# EAGLE design msmobilshield (EAGLE 7.6.0)
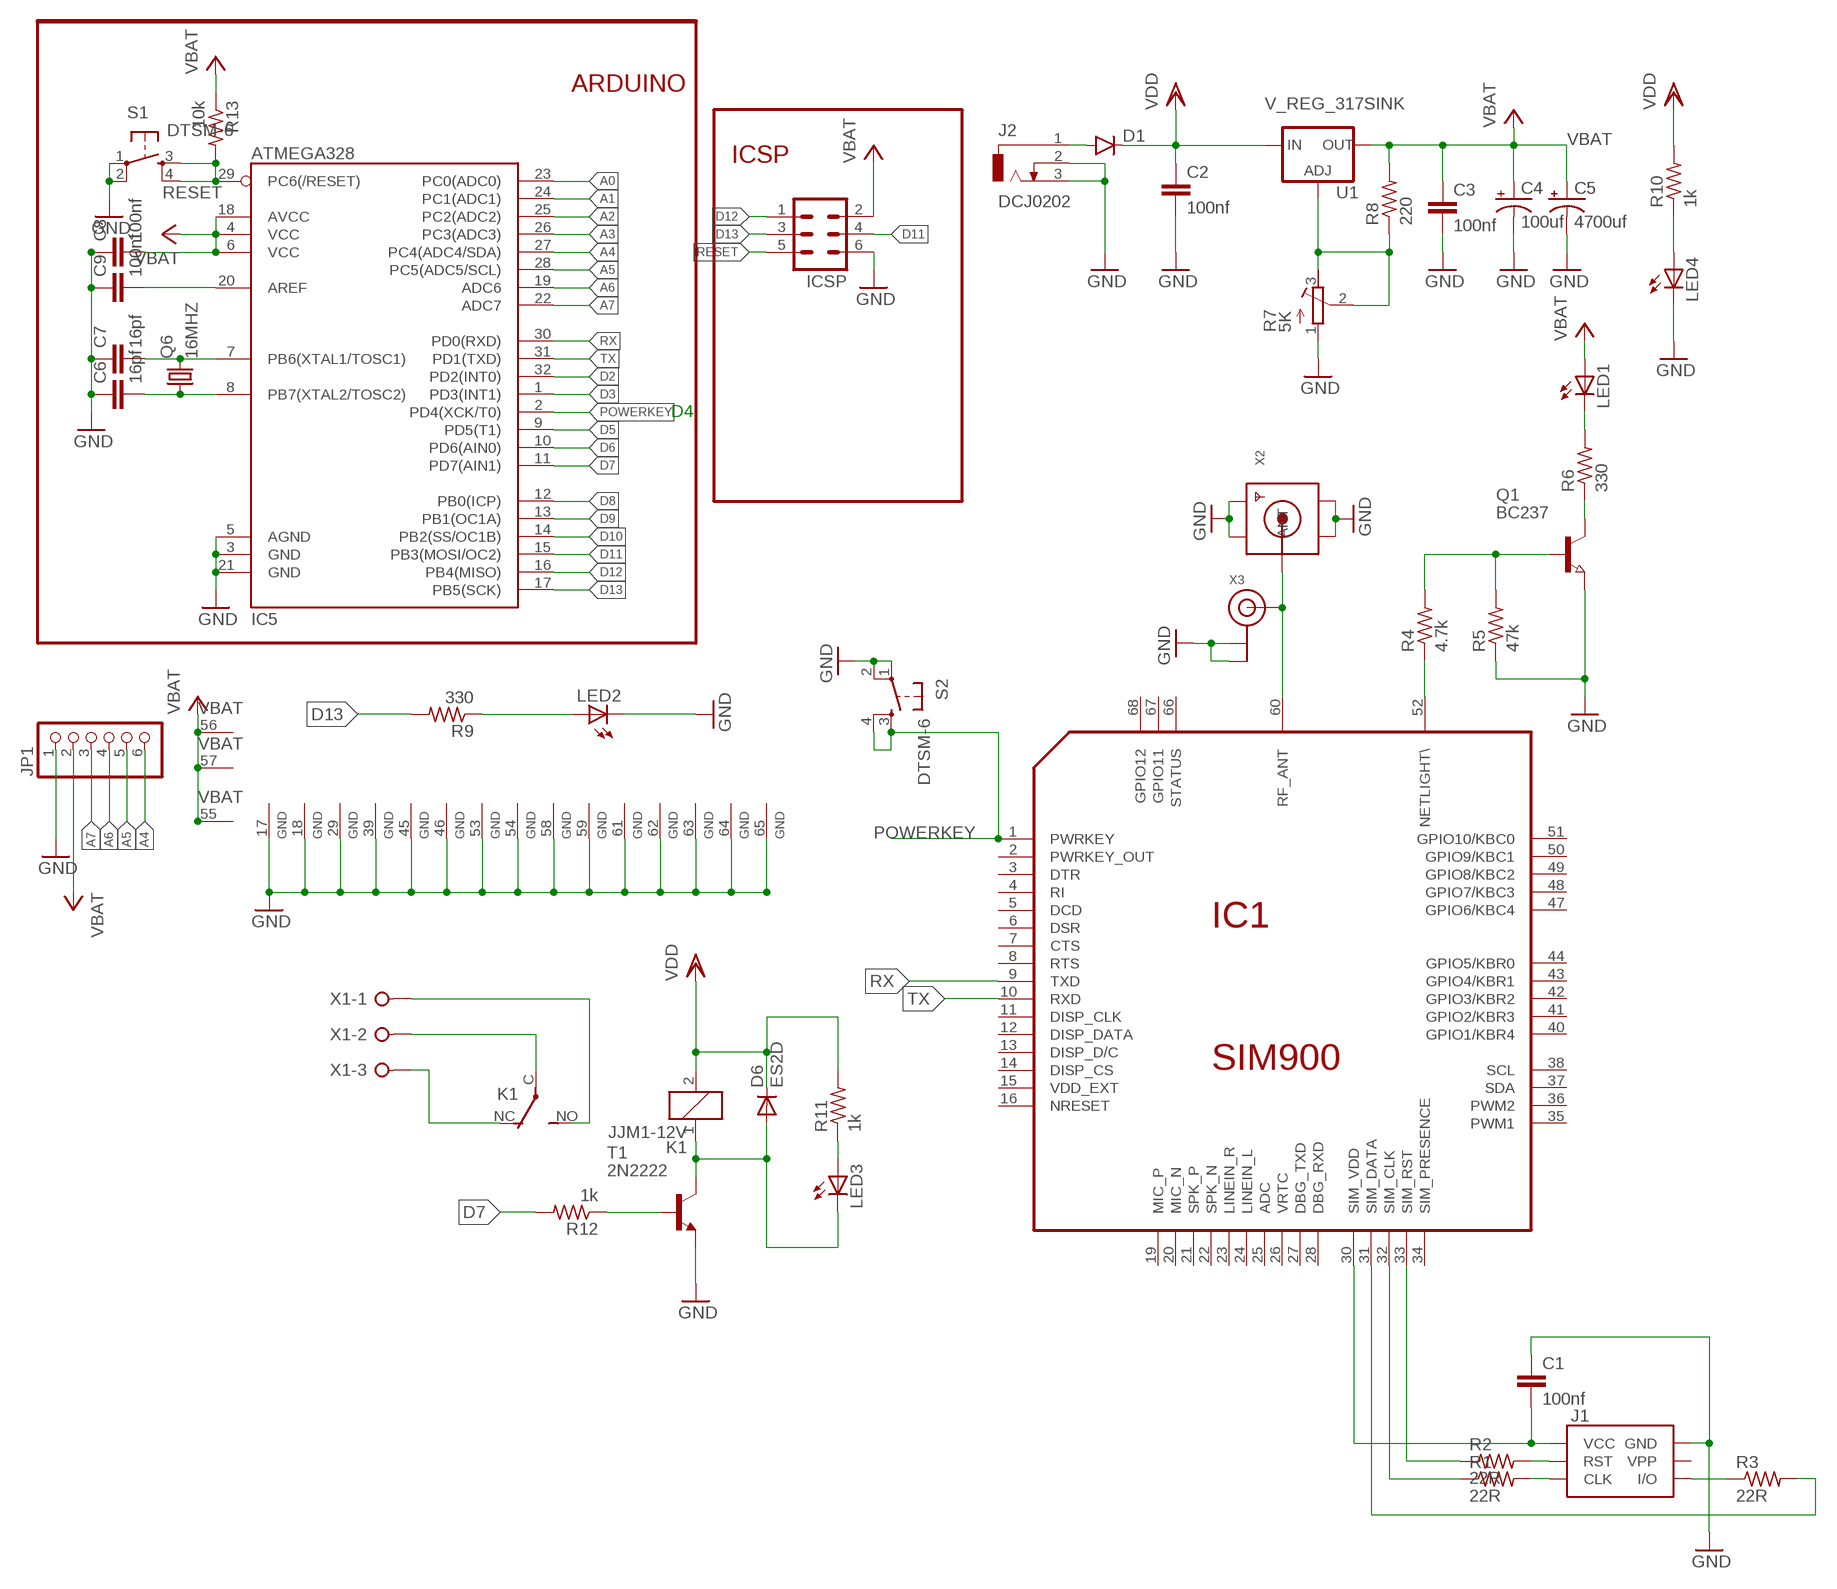
[diagram p0: schematic, sheet 1]

## Parts
C1  100nf  C-EUC0805  [C0805]
C2  100nf  C-EUC0805  [C0805]
C3  100nf  C-EUC0805  [C0805]
C4  100uf  100UF-25V-20%(PTH)  [CPOL-RADIAL-100UF-25V]
C5  4700uf  1000UF-25V(PTH)  [CPOL-RADIAL-1000UF-25V]
C6  16pf  C-EUC0805  [C0805]
C7  16pf  C-EUC0805  [C0805]
C8  100nf  C-EUC0805  [C0805]
C9  100nf  C-EUC0805  [C0805]
D1  DIODESMA  [SMA-DIODE]
D6  ES2D  [SMB]
IC1  SIM900  [SIM900]
IC5  ATMEGA328  ATMEGA168  [TQFP32-08]
ICSP  ML6  [ML6]
J1  SIMHOLDERSIM  [SIMHOLDER]
J2  DCJ0202  [DCJ0202]
JP1  PINHD-1X6  [1X06]
K1  JJM1-12V  [JJM1C]
LED1  LEDCHIPLED_0805  [CHIPLED_0805]
LED2  LEDCHIPLED_0805  [CHIPLED_0805]
LED3  LEDCHIPLED_0805  [CHIPLED_0805]
LED4  LEDCHIPLED_0805  [CHIPLED_0805]
Q1  BC237  NPN-TRANSISTOR_SOT23  [SOT23]
Q6  16MHZ  CRYSTALHC49S  [HC49/S]
R1  22R  R-US_R0805  [R0805]
R2  22R  R-US_R0805  [R0805]
R3  22R  R-US_R0805  [R0805]
R4  4.7k  R-US_R0805  [R0805]
R5  47k  R-US_R0805  [R0805]
R6  330  R-US_R0805  [R0805]
R7  5K  R-TRIMM3103  [RTRIM3103]
R8  220  R-US_R0805  [R0805]
R9  330  R-US_R0805  [R0805]
R10  1k  R-US_R0805  [R0805]
R11  1k  R-US_R0805  [R0805]
R12  1k  R-US_R0805  [R0805]
R13  10k  R-US_R0805  [R0805]
S1  DTSM-6  [DTSM-6]
S2  DTSM-6  [DTSM-6]
T1  2N2222  MMBT2222ALT1-NPN-SOT23-BEC  [SOT23-BEC]
U1  V_REG_317SINK  [TO220-ADJ]
X1  W237-3E  [W237-3E]
X2  SMACONNECTOR  [SMA90_DIP]
X3  ANTENNA_U.FL  [U.FL]

## Nets
A0: IC5.23(PC0(ADC0))
A1: IC5.24(PC1(ADC1))
A2: IC5.25(PC2(ADC2))
A3: IC5.26(PC3(ADC3))
A4: IC5.27(PC4(ADC4/SDA)) JP1.6
A5: IC5.28(PC5(ADC5/SCL)) JP1.5
A6: IC5.19(ADC6) JP1.4
A7: IC5.22(ADC7) JP1.3
D2: IC5.32(PD2(INT0))
D3: IC5.1(PD3(INT1))
D5: IC5.9(PD5(T1))
D6: IC5.10(PD6(AIN0))
D7: IC5.11(PD7(AIN1)) R12.2
D8: IC5.12(PB0(ICP))
D9: IC5.13(PB1(OC1A))
D10: IC5.14(PB2(SS/OC1B))
D11: IC5.15(PB3(MOSI/OC2)) ICSP.4
D12: IC5.16(PB4(MISO)) ICSP.1
D13: IC5.17(PB5(SCK)) ICSP.3 R9.2
GND: C1.1 C2.2 C3.2 C4.2(-) C5.- C6.1 C7.1 C8.1 C9.1 IC1.17(GND) IC1.18(GND) IC1.29(GND) IC1.39(GND) IC1.45(GND) IC1.46(GND) IC1.53(GND) IC1.54(GND) IC1.58(GND) IC1.59(GND) IC1.61(GND) IC1.62(GND) IC1.63(GND) IC1.64(GND) IC1.65(GND) IC5.3(GND) IC5.5(AGND) IC5.21(GND) ICSP.6 J1.C5(GND) J2.2 J2.3 JP1.1 LED2.C LED4.C Q1.2(E) R5.1 R7.1(A) S1.1 S1.2 S2.1 S2.2 T1.E X2.GND1 X2.GND2 X2.GND3 X2.GND4 X3.1(GND) X3.2(GND)
N$1: J1.C2(RST) R2.2
N$2: J1.C3(CLK) R1.2
N$3: J1.C7(I/O) R3.1
N$4: IC1.33(SIM_RST) R2.1
N$5: IC1.32(SIM_CLK) R1.1
N$6: IC1.31(SIM_DATA) R3.2
N$7: C1.2 IC1.30(SIM_VDD) J1.C1(VCC)
N$8: IC1.60(RF_ANT) X2.ANTENNA(ANT) X3.3(SIGNAL)
N$9: IC1.52(NETLIGHT\) R4.1
N$10: Q1.1(B) R4.2 R5.2
N$11: K1.C(2:P) X1.2
N$12: Q1.3(C) R6.1
N$13: LED1.C R6.2
N$14: K1.NC(2:O) X1.3
N$15: D1.A J2.1
N$16: K1.NO(2:S) X1.1
N$17: R7.2(S) R7.3(E) R8.1 U1.ADJ
N$18: LED2.A R9.1
N$19: LED4.A R10.1
N$34: C7.2 IC5.7(PB6(XTAL1/TOSC1)) Q6.2
N$35: C6.2 IC5.8(PB7(XTAL2/TOSC2)) Q6.1
N$36: C9.2 IC5.20(AREF)
N$38: R12.1 T1.B
N$40: D6.A K1.1 LED3.C T1.C
N$41 [vcc]: LED3.A R11.1
POWERKEY: IC1.1(PWRKEY) IC5.2(PD4(XCK/T0)) S2.3 S2.4
RESET: IC5.29(PC6(/RESET)) ICSP.5 R13.2 S1.3 S1.4
RX: IC1.9(TXD) IC5.30(PD0(RXD))
TX: IC1.10(RXD) IC5.31(PD1(TXD))
VBAT: C3.1 C4.1(+) C5.+ C8.2 IC1.55(VBAT) IC1.56(VBAT) IC1.57(VBAT) IC5.4(VCC) IC5.6(VCC) IC5.18(AVCC) ICSP.2 JP1.2 LED1.A R8.2 R13.1 U1.OUT
VDD: C2.1 D1.C D6.C K1.2 R10.2 R11.2 U1.IN
Unconnected: IC1.2(PWRKEY_OUT) IC1.3(DTR) IC1.4(RI) IC1.5(DCD) IC1.6(DSR) IC1.7(CTS) IC1.8(RTS) IC1.11(DISP_CLK) IC1.12(DISP_DATA) IC1.13(DISP_D/C) IC1.14(DISP_CS) IC1.15(VDD_EXT) IC1.16(NRESET) IC1.19(MIC_P) IC1.20(MIC_N) IC1.21(SPK_P) IC1.22(SPK_N) IC1.23(LINEIN_R) IC1.24(LINEIN_L) IC1.25(ADC) IC1.26(VRTC) IC1.27(DBG_TXD) IC1.28(DBG_RXD) IC1.34(SIM_PRESENCE) IC1.35(PWM1) IC1.36(PWM2) IC1.37(SDA) IC1.38(SCL) IC1.40(GPIO1/KBR4) IC1.41(GPIO2/KBR3) IC1.42(GPIO3/KBR2) IC1.43(GPIO4/KBR1) IC1.44(GPIO5/KBR0) IC1.47(GPIO6/KBC4) IC1.48(GPIO7/KBC3) IC1.49(GPIO8/KBC2) IC1.50(GPIO9/KBC1) IC1.51(GPIO10/KBC0) IC1.66(STATUS) IC1.67(GPIO11) IC1.68(GPIO12) J1.C6(VPP)

## Notes on the sheet
- ARDUINO
- ICSP
- D4

## Library data of the parts
C1-C3 C6-C9 = resistor:C-EU: CAPACITOR, European symbol
C4 = SparkFun-Capacitors:100UF-25V-20%(PTH): CAP-08439; PROD_ID: CAP-08439
C5 = SparkFun-Capacitors:1000UF-25V(PTH): CAP-08070; PROD_ID: CAP-09538; VALUE: CAP-09538
D1 = SparkFun-DiscreteSemi:DIODE: Diode These are standard reverse protection diodes and small signal diodes. SMA package can handle up to about 1A. SOD-323 can handle about 200mA. What the SOD-323 package when ordering, there are some mfgs out there that are 5-pin packages.
D6 = diode:ES2D: DIODE super fast rectifier, 2 A
IC1 = sim900:SIM900
IC5 = SparkFun:ATMEGA168
ICSP = con-harting-ml:ML6: HARTING
J1 = SparkFun-Connectors:SIMHOLDER: SIM Socket Socket for SIM cellular cards. Schematic element and footprint production proven. Spark Fun Electronics SKU : PRT-00548; PROD_ID: CONN-08536
J2 = con-jack:DCJ0202: DC POWER JACK Source: DCJ0202.pdf; OC_FARNELL: unknown; OC_NEWARK: unknown
JP1 = adafruit:PINHD-1X6: PIN HEADER
K1 = relay:JJM1-12V: HALF-SIZE AUTOMOTIVE RELAY NAiS Source: http://www.mew-europe.com/.. en_ds_61210_0001.pdf; MF: AROMAT/ MATSUSHITA; MPN: JJM1-12V; OC_FARNELL: unknown; OC_NEWARK: 10C7318
LED1-LED4 = adafruit:LED: LED OSRAM: - CHIPLED LG R971, LG N971, LY N971, LG Q971, LY Q971, LO R971, LY R971 LH N974, LH R974 LS Q976, LO Q976, LY Q976 LO Q996 - Hyper CHIPLED LW Q18S LB Q993, LB Q99A, LB R99A - SideLED LS A670, LO A670, LY A670, LG A670, LP A670 LB A673, LV A673, LT A673, LW A673 LH A674 LY A675 LS A676, LA A676, LO A676, LY A676, LW A676 LS A679, LY A679, LG A679 - Hyper Micro SIDELED® LS Y876, LA Y876, LO Y876, LY Y876 LT Y87S - SmartLED LW L88C, LW L88S LB L89C, LB L89S, LG L890 LS L89K, LO L89K, LY L89K LS L896, LA L896, LO L896, LY L896 - TOPLED LS T670, LO T670, LY T670, LG T670, LP T670 LSG T670, LSP T670, LSY T670, LOP T670, LYG T670 LG T671, LOG T671, LSG T671 LB T673, LV T673, LT T673, LW T673 LH T674 LS T676, LA T676, LO T676, LY T676, LB T676, LH T676, LSB T676, LW T676 LB T67C, LV T67C, LT T67C, LS T67K, LO T67K, LY T67K, LW E67C LS E67B, LA E67B, LO E67B, LY E67B, LB E67C, LV E67C, LT E67C LW T67C LS T679, LY T679, LG T679 LS T770, LO T770, LY T770, LG T770, LP T770 LB T773, LV T773, LT T773, LW T773 LH T774 LS E675, LA E675, LY E675, LS T675 LS T776, LA T776, LO T776, LY T776, LB T776 LHGB T686 LT T68C, LB T68C - Hyper Mini TOPLED® LB M676 - Mini TOPLED Santana® LG M470 LS M47K, LO M47K, LY M47K Source: http://www.osram.convergy.de/
Q1 = semicon-smd-ipc:NPN-TRANSISTOR_: NPN TRANSISTOR
Q6 = crystal:CRYSTAL: CRYSTAL
R1-R6 R8-R13 = resistor:R-US_: RESISTOR, American symbol
R7 = resistor:R-TRIMM: Trimm resistor
S1 S2 = switch-tact:DTSM-6
T1 = transistor:*-NPN-: NPN Transistror BF959 corrected 2008.03.06
U1 = SparkFun-PowerIC:V_REG_317: Voltage Regulator Standard LM317 adjustable voltage regulator. AOI (Adjust Output Input). Google 'LM317 Calculator' for easy to use app to get the two resistor values needed. 240/720 for 5V output. 240/390 for 3.3V output. Spark Fun Electronics SKU : COM-00527
X1 = con-wago-508:W237-3E: WAGO SREW CLAMP; OC_FARNELL: unknown; OC_NEWARK: unknown
X2 = adafruit:SMACONNECTOR: SMA Connector 90° DIP SMA Connector, 50 Ohm (4UConnector: 07259)
X3 = adafruit:ANTENNA_U.FL: U.FL Antenna Connector

## Net classes
0 default: width 0.254 mm, clearance 0.254 mm
1 vcc: width 0.305 mm
2 motors: width 1.016 mm

## Board
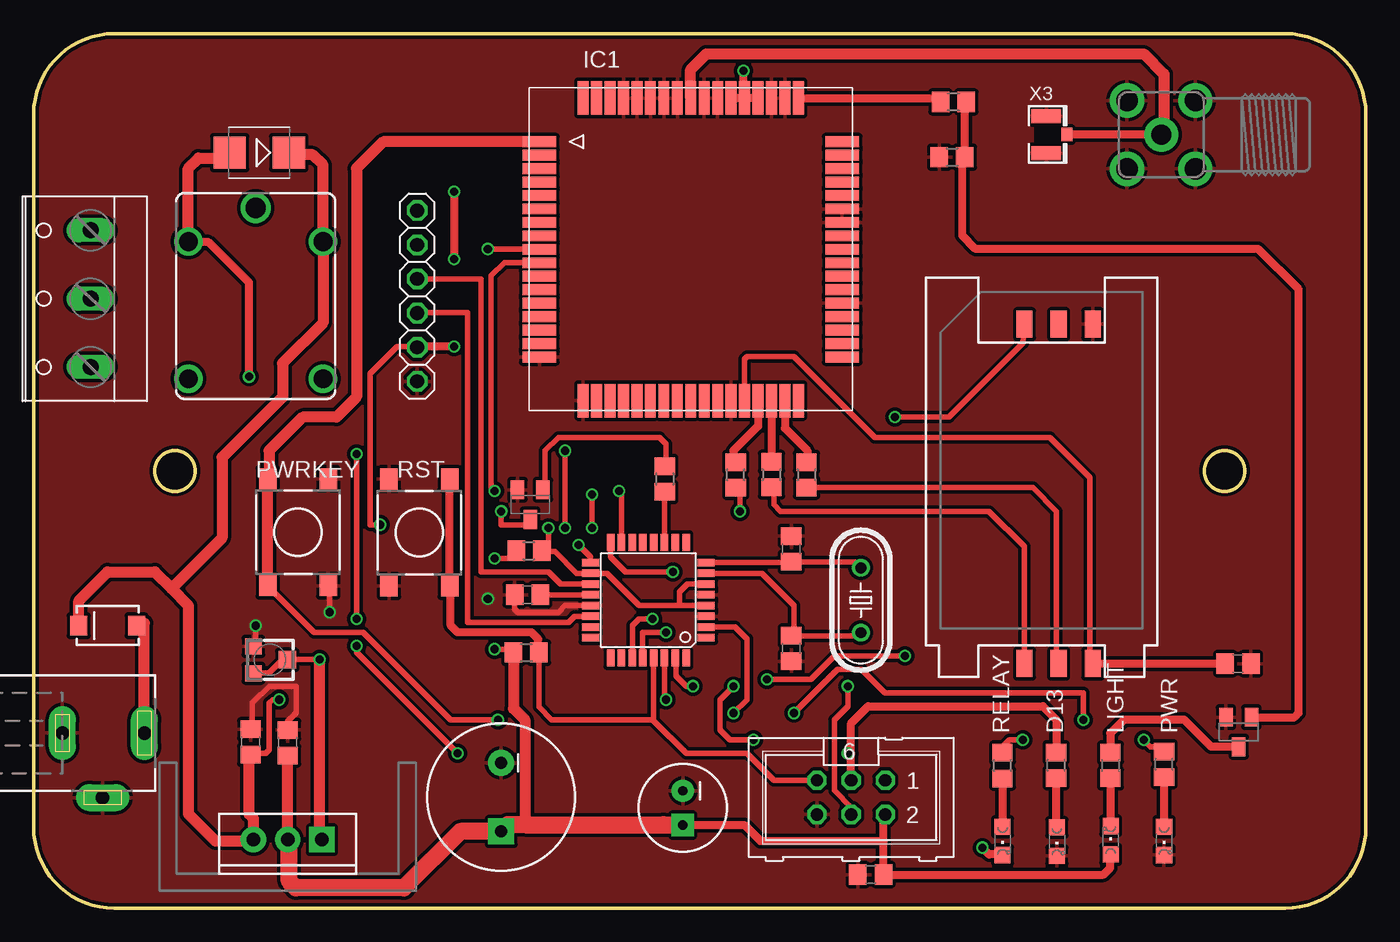
[diagram p1: board, top side]
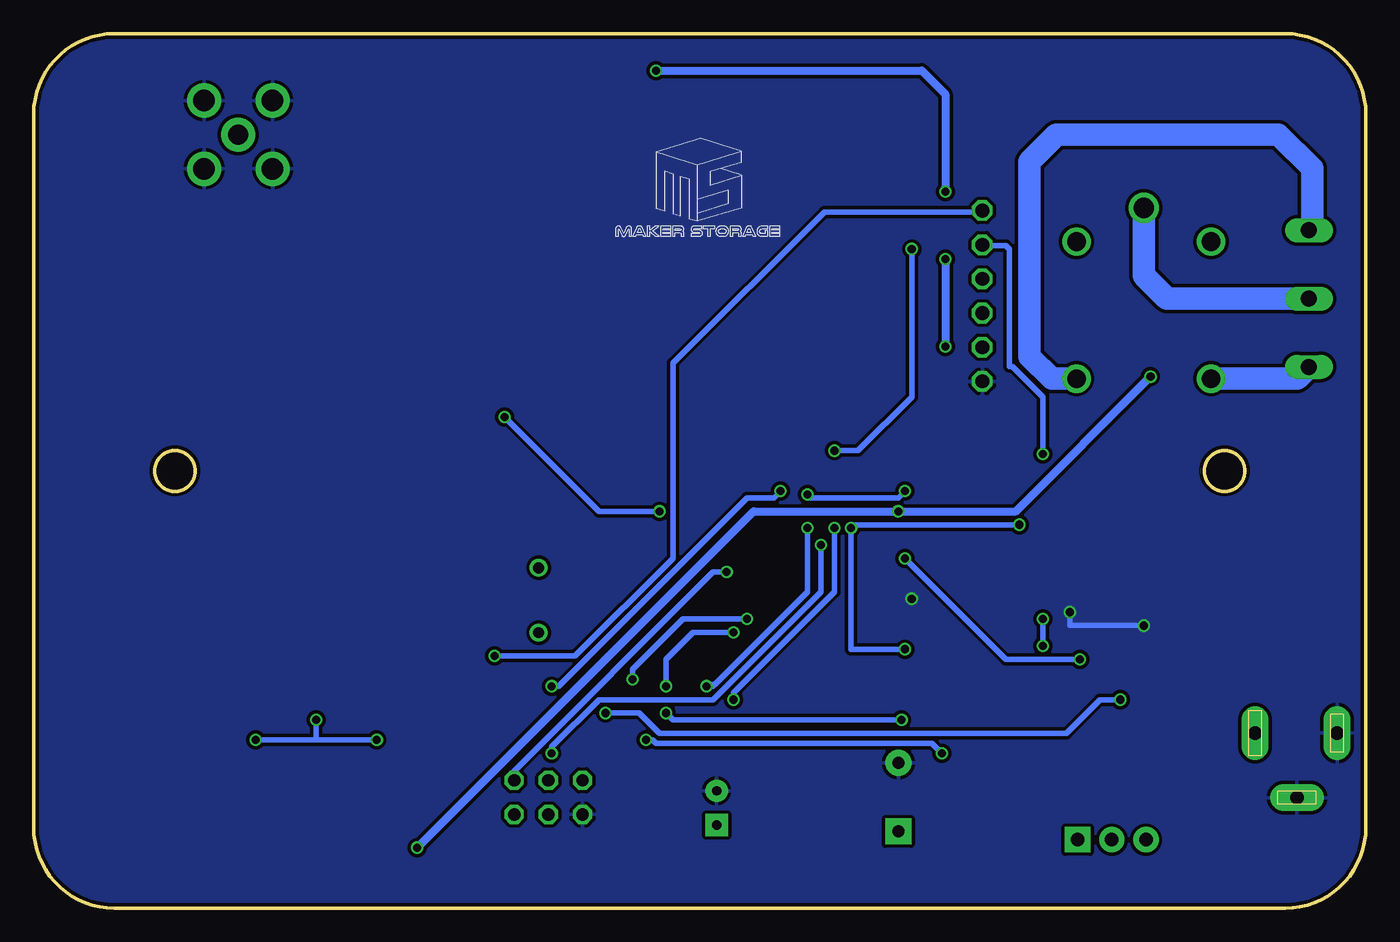
[diagram p2: board, bottom side, seen from below]

Size 99 x 65 mm. Coordinates in mm from the lower left corner, seen from the top.
Outline: 0,6 0,59 arc-90 6,65 93,65 arc-90 99,59 99,6 arc-90 93,0 6,0 arc-90 0,6
Outline: circle at 10.5,32.5 radius 1.5
Outline: circle at 88.5,32.5 radius 1.5
Copper layers (1*16): Top 0.035mm / dielectric 1.5mm / Bottom 0.035mm
Design rules "SeeedStudio_2layer_DRU_no_angle_20140221": minimum track width 6mil, minimum drill 12mil, track to track 6mil, track to pad 6mil, pad to pad 6mil, via to via 6mil, smd to smd 0mil, copper to edge 10mil, drill to drill 10mil, minimum pad ring 10mil, minimum via ring 6mil, stop-mask expansion 2mil, vias tented up to drill 100mil, thermal gap 10mil

### Footprints (pad centres in the part's own frame; a part is rotated, then mirrored left to right if it is on the bottom)
C0805 = smd 1.3 x 1.5: 1 -0.95,0; 2 0.95,0
CPOL-RADIAL-100UF-25V = drill 0.7 pad 1.651 square: 1 1.27,0 | drill 0.7 pad 1.651: 2 -1.27,0
CPOL-RADIAL-1000UF-25V = drill 0.9 pad 1.93 square: + 2.54,0 | drill 0.9 pad 1.93: - -2.54,0
SMA-DIODE = smd 1.27 x 1.47: A -2.15,0; C 2.15,0
SMB = smd 2.4 x 2.4: A 2.2,0; C -2.2,0
SIM900 = smd 2.5 x 0.8: 1 -11.25,8; 2 -11.25,7; 3 -11.25,6; 4 -11.25,5; 5 -11.25,4; 6 -11.25,3; 7 -11.25,2; 8 -11.25,1; 9 -11.25,0; 10 -11.25,-1; 11 -11.25,-2; 12 -11.25,-3; 13 -11.25,-4; 14 -11.25,-5; 15 -11.25,-6; 16 -11.25,-7; 17 -11.25,-8; 35 11.25,-8; 36 11.25,-7; 37 11.25,-6; 38 11.25,-5; 39 11.25,-4; 40 11.25,-3; 41 11.25,-2; 42 11.25,-1; 43 11.25,0; 44 11.25,1; 45 11.25,2; 46 11.25,3; 47 11.25,4; 48 11.25,5; 49 11.25,6; 50 11.25,7; 51 11.25,8 | smd 0.8 x 2.5: 18 -8,-11.25; 19 -7,-11.25; 20 -6,-11.25; 21 -5,-11.25; 22 -4,-11.25; 23 -3,-11.25; 24 -2,-11.25; 25 -1,-11.25; 26 0,-11.25; 27 1,-11.25; 28 2,-11.25; 29 3,-11.25; 30 4,-11.25; 31 5,-11.25; 32 6,-11.25; 33 7,-11.25; 34 8,-11.25; 52 8,11.25; 53 7,11.25; 54 6,11.25; 55 5,11.25; 56 4,11.25; 57 3,11.25; 58 2,11.25; 59 1,11.25; 60 0,11.25; 61 -1,11.25; 62 -2,11.25; 63 -3,11.25; 64 -4,11.25; 65 -5,11.25; 66 -6,11.25; 67 -7,11.25; 68 -8,11.25
TQFP32-08 = smd 1.27 x 0.559: 1 -4.293,2.8; 2 -4.293,2; 3 -4.293,1.2; 4 -4.293,0.4; 5 -4.293,-0.4; 6 -4.293,-1.2; 7 -4.293,-2; 8 -4.293,-2.8; 17 4.293,-2.8; 18 4.293,-2; 19 4.293,-1.2; 20 4.293,-0.4; 21 4.293,0.4; 22 4.293,1.2; 23 4.293,2; 24 4.293,2.8 | smd 0.559 x 1.27: 9 -2.8,-4.293; 10 -2,-4.293; 11 -1.2,-4.293; 12 -0.4,-4.293; 13 0.4,-4.293; 14 1.2,-4.293; 15 2,-4.293; 16 2.8,-4.293; 25 2.8,4.293; 26 2,4.293; 27 1.2,4.293; 28 0.4,4.293; 29 -0.4,4.293; 30 -1.2,4.293; 31 -2,4.293; 32 -2.8,4.293
ML6 = drill 0.914 octagon: 1 -2.54,-1.27; 2 -2.54,1.27; 3 0,-1.27; 4 0,1.27; 5 2.54,-1.27; 6 2.54,1.27
SIMHOLDER = smd 2 x 1.2: C1 -12.61,-3.81; C2 -12.61,-1.27; C3 -12.61,1.27; C5 12.61,-3.81; C6 12.61,-1.27; C7 12.61,1.27
DCJ0202 = drill 1 pad 2 long: 1 0,3.1; 2 4.8,0; 3 0,-3
1X06 = drill 1.016 octagon: 1 -6.35,0; 2 -3.81,0; 3 -1.27,0; 4 1.27,0; 5 3.81,0; 6 6.35,0
JJM1C = drill 1.4: 1 4.05,5; 2 4.05,-5; NC -6.15,-5; NO -6.15,5 | drill 1.5: C 6.55,0
CHIPLED_0805 = smd 1.2 x 1.2: A 0,-1.05; C 0,1.05
SOT23 = smd 1 x 1.4: 1 -0.95,-1.1; 2 0.95,-1.1; 3 0,1.1
HC49/S = drill 0.813: 1 -2.413,0; 2 2.413,0
R0805 = smd 1.3 x 1.5: 1 -0.95,0; 2 0.95,0
RTRIM3103 = smd 1.2 x 1.25: 1 -1,-1.225; 3 1,-1.225 | smd 1.3 x 1.3: 2 0,1.3
DTSM-6 = smd 1.55 x 1.3: 1 -3.975,2.25; 2 3.975,2.25; 3 -3.975,-2.25; 4 3.975,-2.25
SOT23-BEC = smd 1 x 1.4: B -0.95,-1.1; C 0,1.1; E 0.95,-1.1
TO220-ADJ = drill 1 pad 1.88 square: ADJ -2.54,0 | drill 1 pad 1.88: IN 2.54,0; OUT 0,0
W237-3E = drill 1.194 long: 1 -5.08,-0.635; 2 0,-0.635; 3 5.08,-0.635
SMA90_DIP = drill 1.5 pad 2.54: ANTENNA 0,0 | drill 1.6 pad 2.54: GND1 -2.54,2.54; GND2 2.54,2.54; GND3 -2.54,-2.54; GND4 2.54,-2.54
U.FL = smd 2.2 x 1.05: 1 0,1.375; 2 0,-1.375 | smd 0.8 x 1: 3 1.525,0

### Placement (x,y rotation side)
C1  89.5,18.17 180 top
C2  16.12,12.35 90 top
C3  18.87,12.3 90 top
C4  48.24,7.45 270 top
C5  34.74,8.25 270 top
C6  56.3,26.7 270 top
C7  56.3,19.3 90 top
C8  62.2,2.5 0 top
C9  36.7,23.3 0 top
D1  5.5,21 180 top
D6  16.76,56.15 180 top
IC1  48.83,48.97 0 top
IC5  45.68,22.89 180 top
ICSP  60.75,8.23 180 top
J1  74.9,30.79 90 top
J2  5.13,13.02 270 top
JP1  28.5,45.5 90 top
K1  16.5,45.5 90 top
LED1  80.04,5.05 0 top
LED2  76.04,4.95 180 top
LED3  72,5 180 top
LED4  84,5 180 top
Q1  89.55,13.1 180 top
Q6  61.47,22.89 270 top
R1  54.83,32.23 270 top
R2  57.43,32.21 270 top
R3  52.17,32.21 90 top
R4  68.35,59.93 0 top
R5  68.25,55.82 0 top
R6  80.02,10.61 270 top
R7  17.55,18.46 270 top
R8  36.81,26.57 0 top
R9  75.98,10.63 90 top
R10  84,10.7 90 top
R11  72,10.6 90 top
R12  46.9,31.9 270 top
R13  36.6,19 0 top
S1  28.66,27.92 90 top
S2  19.64,27.94 270 top
T1  36.9,30 180 top
U1  18.88,5.09 180 top
X1  3.6,45.3 90 top
X2  83.79,57.49 270 top
X3  75.25,57.5 0 top

### Tracks (layer width: path | path; a pad name or v marks a point on that pad's centre or on a via)
A4  (via drill 0.6)
  Top 0.406: v64.75,18.75 59.5,18.75 57.75,17 v54.5,17 | v46,21.5 45,21.5 44.5,21 44.5,18.75 IC5.27
  Bottom 0.406: v64.75,18.75 58.75,18.75 51.5,26 51.5,40.5 40.25,51.75 28.5,51.75 JP1.6 | v54.5,17 54.5,17.75 50.75,21.5 v46,21.5
A5  (via drill 0.6)
  Top 0.406: v24,21.5 v24,33.75 | v24,19.5 24,19 v31.5,11.5 | v53.5,12.5 51.75,12.5 51,13.25 51,15.5 v52,16.5 | v47,20.5 45.25,20.5 45.25,18.75 IC5.28
  Bottom 0.406: v24,33.75 24,38 26.25,40.25 26.5,40.25 26.5,49 26.75,49.25 28.5,49.25 JP1.5 | v24,19.5 v24,21.5 | v31.5,11.5 32.25,12.25 52.75,12.25 53,12.5 v53.5,12.5 | v52,16.5 52,18.5 50,20.5 v47,20.5
A6
  Top 0.406: IC5.19 39.16,24.09 38.25,25 33.25,25 33.25,46.75 28.52,46.75 JP1.4
A7
  Top 0.406: JP1.3 28.73,44.25 32.25,44.25 32.25,21.25 39.75,21.25 40.19,21.69 IC5.22
D7
  Top 0.406: IC5.11 46.88,30.93 R12.2
D11  (via drill 0.6)
  Top 0.406: v60.5,16.5 60.5,15 59.5,14 59.5,8.75 60.75,7.5 ICSP.4 | IC5.15 43.68,30.82 v43.5,31
  Bottom 0.406: v43.5,31 44,30.5 46,30.5 60,16.5 v60.5,16.5
D12  (via drill 0.6)
  Top 0.406: IC5.16 42.88,26.12 44,25 v47.5,25
  Bottom 0.406: v47.5,25 48.5,25 63.5,10 63.5,9.5 ICSP.1
D13  (via drill 0.6)
  Top 0.406: v60.5,11.5 60.75,11.5 | IC5.17 41.39,26.11 v40.5,27
  Top 0.61: ICSP.3 60.75,11.5 60.75,13.75 62,15 75,15 76,14 76,11.6 R9.2
  Bottom 0.406: v40.5,27 40.5,23.5 48.5,15.5 57,15.5 60.5,12 v60.5,11.5
GND  (via drill 0.6)
  Top 0.406: v22,22 22,23.5 S2.2 | v16.5,21 16.5,19.5 R7.1 | IC5.21 39.49,22.49 39,22 36,22 35.75,22.25 C9.1 | C3.2 18.87,13.87 19.5,14.5 19.5,16.5 17.5,16.5 16.25,15.25 16.25,13.43 C2.2
  Bottom 0.406: v22,22 22,21 v16.5,21
  other vias: 33.75,23
  pour Bottom: 0,59 0,6 arc90 6,0 93,0 arc90 99,6 99,59 arc90 93,65 6,66.5 arc90
  pour Top: 0,59.5 0,6 arc90 6,0 93,0 arc90 99,6 99,59 arc90 93,65 6.5,68 arc90
N$1
  Top 0.406: R2.2 74.24,31.26 76,29.5 76,18.35 J1.C2
N$2
  Top 0.406: J1.C3 73.63,26.87 71,29.5 55.5,29.5 55,30 55,31.11 R1.2
N$3  (via drill 0.6)
  Top 0.406: R3.1 52.26,31.26 52.5,31.5 v52.5,29.5 | v64,36.5 68,36.5 73.5,42 J1.C7
  Bottom 0.406: v64,36.5 57,29.5 v52.5,29.5
N$4
  Top 0.61: IC1.33 55.83,35.67 57.5,34 57.5,33.23 R2.1
N$5
  Top 0.61: IC1.32 R1.1
N$6
  Top 0.61: IC1.31 53.83,35.83 52,34 52,33.33 R3.2
N$7
  Top 0.406: IC1.30 52.83,40.83 53,41 56.5,41 62.5,35 75.5,35 78.5,32 78.5,18.39 J1.C1
  Top 0.61: J1.C1 C1.2
N$8
  Top 0.61: X2.ANTENNA X3.3
  Top 0.813: IC1.60 48.83,62.33 50,63.5 82.5,63.5 84,62 84,57.7 X2.ANTENNA
N$9
  Top 0.61: IC1.52 67.11,60.22 R4.1
N$10
  Top 0.61: Q1.1 93.7,14.2 94,14.5 94,46 91,49 70,49 69,50 69,55.62 R5.2 69.2,59.83 R4.2
N$11
  Bottom 1.676: X1.2 14.8,45.3 16.5,47 K1.C
N$12
  Top 0.61: Q1.3 87.5,12 85.5,14 81,14 80,13 80,11.58 R6.1
N$13
  Top 0.61: R6.2 80.02,6.12 LED1.C
N$14
  Bottom 1.676: K1.NC 23.35,39.35 25,41 25,55.5 23,57.5 6.5,57.5 4,55 4,50.62 X1.3
N$15
  Top 0.813: J2.1 8.23,21.17 D1.A
N$16
  Bottom 1.676: K1.NO 5.11,39.35 X1.1
N$17  (via drill 0.6)
  Top 0.406: 16.5,17.25 R7.3 16.5,17.5 17.5,17.5 18.5,18.5 18.75,18.5 R7.2 19,18.5 v21.25,18.5 | 21.25,5.25 U1.ADJ | v34.25,26 35.75,26 35.75,26.5 R8.1
  Top 0.813: 21.25,5.25 v21.25,18.5
  Bottom 0.406: v34.25,26 26.75,18.5 v21.25,18.5
N$18
  Top 0.61: R9.1 75.98,6.06 LED2.A
N$19
  Top 0.61: R10.1 LED4.A
N$34
  Top 0.406: Q6.2 61.24,20.25 C7.2 56.5,20.45 56.5,22.5 54.11,24.89 IC5.7
N$35
  Top 0.406: IC5.8 56.24,25.69 C6.2 61.02,25.75 Q6.1
N$36
  Top 0.406: IC5.20 C9.2
N$38
  Top 0.406: 38,31.25 T1.B 38,31.5 38,34 39,35 46.5,35 47,34.5 47,32.95 R12.1
N$40  (via drill 0.6)
  Top 0.406: T1.C 36.5,28.5 34.75,28.5 v34.75,29.5
  Top 0.61: v16,39.5 16,46.5 13,49.5 11.5,49.5 K1.1 | v70.5,4.5 71,4 72,4 LED3.C
  Top 0.813: K1.1 11.5,55 12.25,55.75 14.16,55.75 D6.A
  Bottom 0.61: v16,39.5 26,29.5 v34.75,29.5 45.5,29.5 v70.5,4.5
N$41
  Top 0.61: R11.1 LED3.A
POWERKEY  (via drill 0.6)
  Top 0.406: IC5.2 52.11,20.89 53,20 53,15.5 v52,14.5 | v34.5,14 31,14 24.5,20.5 20.86,20.5 S2.4
  Top 0.813: S2.4 S2.3 17.5,32.02 17.5,34 20,36.5 22.5,36.5 24,38 24,55 25.97,56.97 IC1.1
  Bottom 0.406: v34.5,14 51.5,14 v52,14.5
RESET
  Top 0.406: 37.5,18.45 R13.2 37.55,14.95 38.5,14 46,14 46.08,13.92 | ICSP.5 55,9.5 53,11.5 48.5,11.5 46.08,13.92 | IC5.29 46.08,13.92
  Top 0.61: S1.4 S1.3 31,23.86 31,21 31.5,20.5 37,20.5 37.5,20 37.5,19 R13.2
RX  (via drill 0.6)
  Top 0.406: v39.5,34 v39.5,28.25 | v33.75,49 37.75,49 IC1.9 | IC5.30 46.88,15.62 v47,15.5
  Bottom 0.406: v47,15.5 47,16 39.5,23.5 v39.5,28.25 | v39.5,34 37.75,34 33.75,38 v33.75,49
TX  (via drill 0.6)
  Top 0.406: v41.5,30.75 v41.5,28.25 | IC1.10 37.5,48 35,48 34,47 34,31.25 v34.25,31 | v49,16.5 48.5,16.5 47.75,17.25 47.75,18.53 IC5.31
  Bottom 0.406: 48.5,16.5 v49,16.5 48.88,16.62 48.38,16.62 41.5,23.5 v41.5,28.25 | v41.5,30.75 41.25,30.5 34.75,30.5 v34.25,31
VBAT  (via drill 0.6)
  Top 0.406: 48,22.5 45,22.5 42.61,24.89 IC5.18 40.36,24.89 38.75,26.5 37.83,26.5 R8.2 37.75,26.75 38.25,26.75 v38.25,28.25 | 48,22.5 IC5.4 | IC5.6 48.59,24.09 48,23.5 48,22.5 | v34.25,19.25 35.5,19.25 R13.1 | 28.5,41.75 27,41.75 25,39.75 25,28.5 v25.75,28.5
  Top 0.61: IC1.55 IC1.56 | IC1.56 IC1.57 52,60 | 63.15,5 C8.2 79.5,2.5 80,3 80,3.96 LED1.A | 63.15,5 63.15,6.82 ICSP.2 | C4.1 52.82,6.18 54,5 63.15,5 | v52.75,62.25 52.75,60.5 IC1.56 | v31.25,53.25 v31.25,48.25 | v31.25,41.75 28.5,41.75 JP1.2
  Top 0.813: U1.OUT C3.1 | R13.1 35.65,14.85 36.5,14 36.5,6.21
  Top 1.27: U1.OUT 19,4.97 19,2 19.5,1.5 27.5,1.5 31.71,5.71 C5.+ 35.24,6.21 36.5,6.21 46.77,6.21 C4.1
  Bottom 0.406: v34.25,19.25 38.25,19.25 v38.25,28.25 38,28.5 v25.75,28.5
  Bottom 0.61: v31.25,48.25 v31.25,41.75 | v52.75,62.25 33,62.25 31.25,60.5 v31.25,53.25
VDD  (via drill 0.6)
  Top 0.406: v56.5,14.5 59.75,17.75 61.5,17.75 63.25,16 78,16 v78,14 | v82.5,12.5 83,12 84,12 R10.2 | C2.1 16.27,11.5 17.25,11.5 17.5,11.75 17.5,15.25 17.75,15.5 v18.25,15.5 | v73.5,12.5 72.5,12.5 72,12 R11.2
  Top 0.813: 16.09,11.37 C2.1 16,11.28 16,7 16.34,6.66 U1.IN 16,5 13.5,5 11.5,7 11.5,22.5 10.25,23.75 | D1.C 3.35,22.85 5.5,25 9,25 10.25,23.75 | 10.25,23.75 14,27.5 14,33.5 18.5,38 18.5,40.5 21.5,43.5 K1.2 21.5,55.25 20.75,56 19.11,56 D6.C
  Bottom 0.406: v56.5,14.5 54,14.5 52.5,13 22.25,13 19.75,15.5 v18.25,15.5 | 78,12.5 v78,14 | v82.5,12.5 78,12.5 | 78,12.5 v73.5,12.5

### Text on the board
tPlace: PWRKEY | RST | RELAY | D13 | LIGHT | PWR